# Altium project MB1520.PrjPcb (part 1 of 5)
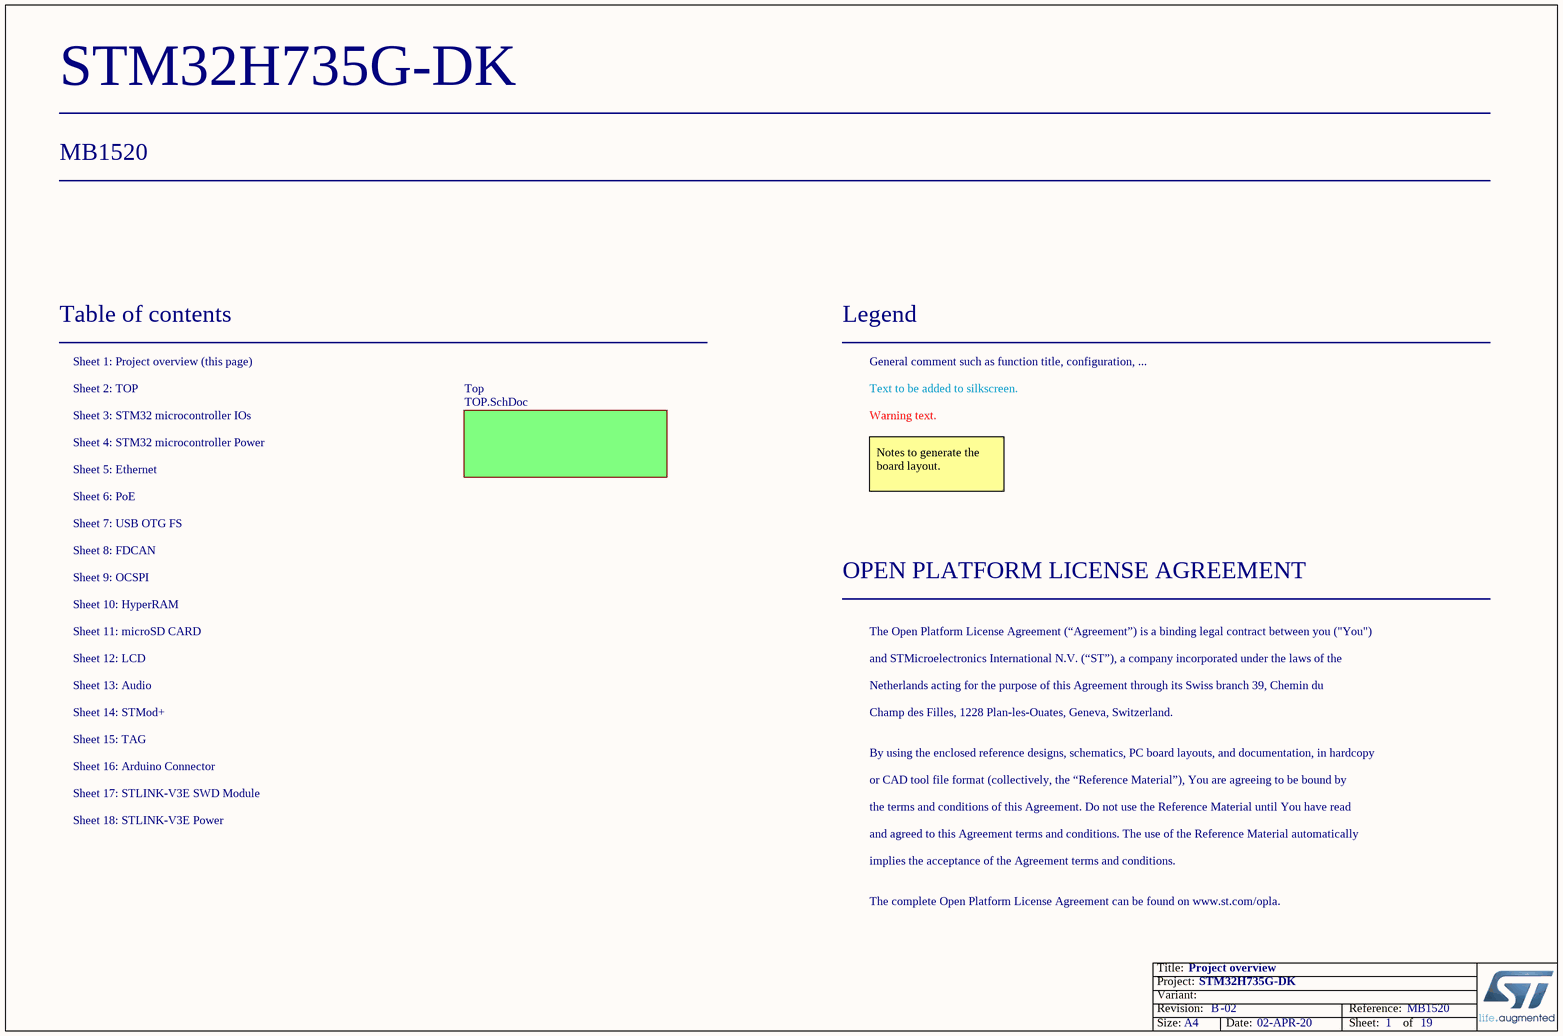
[diagram p0: Project overview.SchDoc]
Board_Assembly_Revision: 02; Board_Document_Date: 02-APR-20; Board_Name: STM32H735G-DK; Board_PCB_Revision: B; Board_Reference: MB1520
18 sheets, 465 parts. Net scope: flat (ports and power ports of the same name join across sheets).
Board file: MB1520.PcbDoc
Sheets:
  Project overview.SchDoc
    Top = TOP.SchDoc
      Power = STM32 microcontroller Power.SchDoc
      TAG = TAG.SchDoc
      Audio = Audio.SchDoc
      USB_OTG_FS = USB OTG FS.SchDoc
      Arduino = Arduino Connector.SchDoc
      STMod+ = STMod+.SchDoc
      U_MCU = STM32 microcontroller IOs.SchDoc
      U_Ethernet = Ethernet.SchDoc
        PoE = PoE.SchDoc
      FDCANs = FDCAN.SchDoc
      STlink_V3E_Module = STlink_V3E_Module.SchDoc
      STlink_V3E_PWR = STlink_V3E_PWR.SchDoc
      U_OCSPI = OCSPI.SchDoc
      U_LCD = LCD.SchDoc
      U_HyperRAM = HyperRAM.SchDoc
      U_SD CARD = SD CARD.SchDoc

## Sheet Project overview.SchDoc: Project overview
size A4; Date: Not used; ApprovedBy: Not used; CheckedBy: Not used; Author: Not used; CompanyName: STMicroelectronics; DrawnBy: Not used; Engineer: Not used; Organization: Not used; Address1: Not used; Address2: Not used; Address3: Not used; Address4: Not used; DocumentNumber: 2; Revision: Not used; SheetNumber: 1; SheetTotal: 19; CurrentTime: Not used; CurrentDate: Not used; Time: Not used; DocumentFullPathAndName: Not used; DocumentName: Not used; ModifiedDate: Not used; ImagePath: Not used; ProjectName: Not used; Application_BuildNumber: Not used

### Sub-sheets
Top = TOP.SchDoc: no entries

### Notes on the sheet
- Table of contents
- Sheet 1: Project overview (this page)
- Legend
- General comment such as function title, configuration, ...
- Sheet 2: TOP
- Sheet 4: STM32 microcontroller Power
- Sheet 3: STM32 microcontroller IOs
- Text to be added to silkscreen.
- Warning text.
- Sheet 6: PoE
- Sheet 5: Ethernet
- Notes to generate the board layout.
- Sheet 8: FDCAN
- Sheet 7: USB OTG FS
- Sheet 9: OCSPI
- OPEN PLATFORM LICENSE AGREEMENT
- Sheet 10: HyperRAM
- Sheet 11: microSD CARD
- The Open Platform License Agreement (“Agreement”) is a binding legal contract between you ("You")
- Sheet 12: LCD
- Sheet 14: STMod+
- Sheet 13: Audio
- and STMicroelectronics International N.V. (“ST”), a company incorporated under the laws of the
- Netherlands acting for the purpose of this Agreement through its Swiss branch 39, Chemin du
- Champ des Filles, 1228 Plan-les-Ouates, Geneva, Switzerland.
- Sheet 16: Arduino Connector
- Sheet 15: TAG
- By using the enclosed reference designs, schematics, PC board layouts, and documentation, in hardcopy
- or CAD tool file format (collectively, the “Reference Material”), You are agreeing to be bound by
- Sheet 18: STLINK-V3E Power
- Sheet 17: STLINK-V3E SWD Module
- the terms and conditions of this Agreement. Do not use the Reference Material until You have read
- and agreed to this Agreement terms and conditions. The use of the Reference Material automatically
- implies the acceptance of the Agreement terms and conditions.
- The complete Open Platform License Agreement can be found on www.st.com/opla.
- Title:
- Project:
- Size:
- Revision:
- Variant:
- A4
- -
- Date:
- Reference:
- Sheet:
- of

## Sheet TOP.SchDoc: TOP
size A3; CompanyName: STMicroelectronics; Organization: Microcontrollers Division; DocumentNumber: 3; SheetNumber: 2; SheetTotal: 19
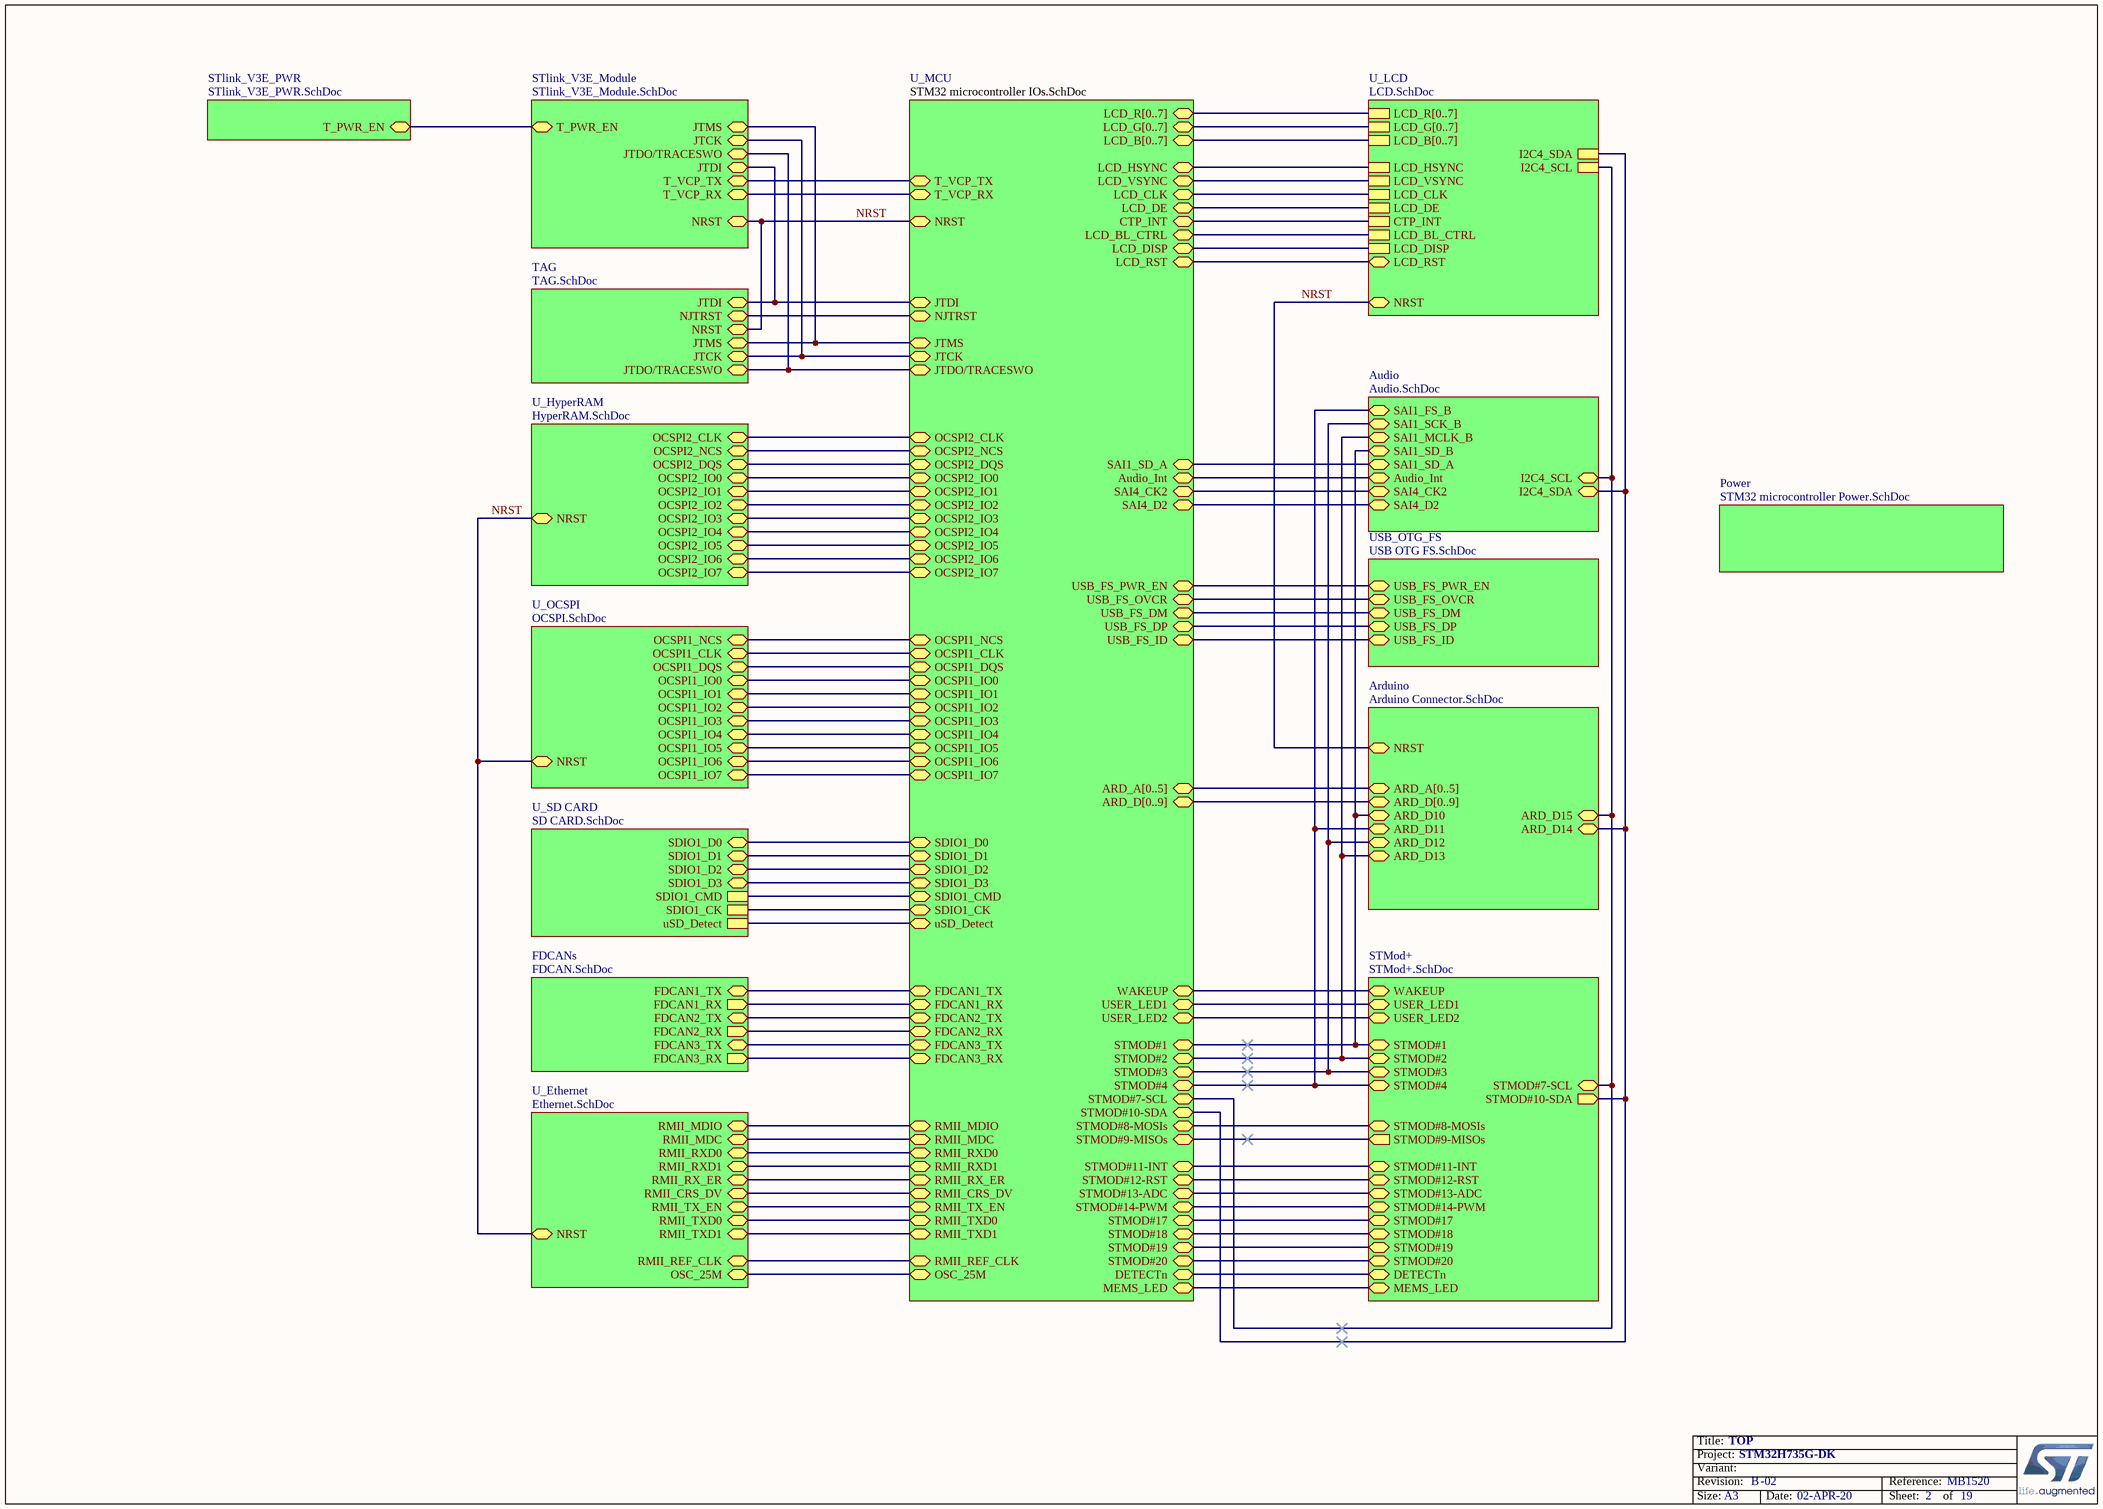
[diagram p1: TOP.SchDoc]

### Sub-sheets
Arduino = Arduino Connector.SchDoc: ARD_D13, ARD_D12, ARD_D11, ARD_D10, ARD_D15, ARD_D14, ARD_A[0..5], ARD_D[0..9], NRST
Audio = Audio.SchDoc: I2C4_SCL, I2C4_SDA, SAI1_SCK_B, SAI1_FS_B, SAI1_SD_B, SAI1_SD_A, Audio_Int, SAI1_MCLK_B, SAI4_D2, SAI4_CK2
FDCANs = FDCAN.SchDoc: FDCAN1_TX, FDCAN2_TX, FDCAN3_TX, FDCAN1_RX (out), FDCAN3_RX (out), FDCAN2_RX (out)
Power = STM32 microcontroller Power.SchDoc: no entries
STlink_V3E_Module = STlink_V3E_Module.SchDoc: T_PWR_EN, T_VCP_TX, T_VCP_RX, JTDO/TRACESWO, JTMS, JTCK, NRST, JTDI
STlink_V3E_PWR = STlink_V3E_PWR.SchDoc: T_PWR_EN
STMod+ = STMod+.SchDoc: STMOD#8-MOSIs, STMOD#14-PWM, STMOD#19, STMOD#20, STMOD#17, STMOD#18, STMOD#1, STMOD#3, STMOD#2, STMOD#4, WAKEUP, USER_LED1, USER_LED2, STMOD#7-SCL, STMOD#10-SDA (out), STMOD#9-MISOs (out), STMOD#12-RST, STMOD#13-ADC, STMOD#11-INT, DETECTn, MEMS_LED
TAG = TAG.SchDoc: JTDO/TRACESWO, JTDI, NJTRST, JTMS, JTCK, NRST
U_Ethernet = Ethernet.SchDoc: OSC_25M, RMII_MDIO, RMII_MDC, RMII_RXD1, RMII_TXD1, RMII_CRS_DV, RMII_RX_ER, RMII_RXD0, RMII_REF_CLK, RMII_TX_EN, RMII_TXD0, NRST
U_HyperRAM = HyperRAM.SchDoc: OCSPI2_NCS (bidir), NRST (bidir), OCSPI2_CLK (bidir), OCSPI2_DQS (bidir), OCSPI2_IO0 (bidir), OCSPI2_IO3 (bidir), OCSPI2_IO1 (bidir), OCSPI2_IO2 (bidir), OCSPI2_IO5 (bidir), OCSPI2_IO4 (bidir), OCSPI2_IO7 (bidir), OCSPI2_IO6 (bidir)
U_LCD = LCD.SchDoc: LCD_R[0..7], I2C4_SDA, I2C4_SCL, LCD_B[0..7], LCD_G[0..7], LCD_HSYNC, LCD_VSYNC, LCD_CLK, LCD_DE, CTP_INT, LCD_BL_CTRL, LCD_DISP, NRST, LCD_RST
U_MCU = STM32 microcontroller IOs.SchDoc: STMOD#14-PWM, STMOD#20, USB_FS_ID, SDIO1_CK, SDIO1_CMD, LCD_DE, LCD_CLK, CTP_INT, USER_LED1, USER_LED2, ARD_A[0..5], ARD_D[0..9], LCD_R[0..7], LCD_G[0..7], LCD_B[0..7], FDCAN3_RX, FDCAN3_TX, T_VCP_TX, T_VCP_RX, FDCAN2_RX, FDCAN2_TX, FDCAN1_TX, FDCAN1_RX, LCD_DISP, LCD_VSYNC, LCD_BL_CTRL, LCD_HSYNC, JTDI, JTDO/TRACESWO, NJTRST, JTCK, JTMS, OCSPI2_NCS, OCSPI1_DQS, OCSPI1_NCS, OCSPI1_CLK, OCSPI2_DQS, OSC_25M, USB_FS_DP, USB_FS_DM, USB_FS_OVCR, USB_FS_PWR_EN, WAKEUP, SAI1_SD_A, SAI4_D2, SAI4_CK2, Audio_Int, STMOD#1, STMOD#2, STMOD#3, STMOD#4, STMOD#19, STMOD#17, STMOD#18, STMOD#10-SDA, STMOD#7-SCL, STMOD#8-MOSIs, STMOD#9-MISOs, STMOD#11-INT, STMOD#13-ADC, STMOD#12-RST, MEMS_LED, DETECTn, uSD_Detect, RMII_RXD1, RMII_RXD0, RMII_CRS_DV, RMII_RX_ER, RMII_TX_EN, RMII_TXD0, RMII_TXD1, RMII_MDIO, RMII_MDC, RMII_REF_CLK, SDIO1_D1, SDIO1_D0, SDIO1_D2, SDIO1_D3, OCSPI2_CLK, NRST, OCSPI1_IO7, OCSPI1_IO4, OCSPI1_IO5, OCSPI1_IO0, OCSPI1_IO1, OCSPI1_IO3, OCSPI1_IO2, OCSPI1_IO6, OCSPI2_IO7, OCSPI2_IO6, OCSPI2_IO5, OCSPI2_IO0, OCSPI2_IO2, OCSPI2_IO1, OCSPI2_IO4, OCSPI2_IO3, LCD_RST
U_OCSPI = OCSPI.SchDoc: OCSPI1_NCS (bidir), OCSPI1_CLK (bidir), NRST, OCSPI1_DQS (bidir), OCSPI1_IO0 (bidir), OCSPI1_IO1 (bidir), OCSPI1_IO2 (bidir), OCSPI1_IO3 (bidir), OCSPI1_IO4 (bidir), OCSPI1_IO5 (bidir), OCSPI1_IO6 (bidir), OCSPI1_IO7 (bidir)
U_SD CARD = SD CARD.SchDoc: SDIO1_CK, SDIO1_CMD, uSD_Detect, SDIO1_D1, SDIO1_D0, SDIO1_D2, SDIO1_D3
USB_OTG_FS = USB OTG FS.SchDoc: USB_FS_ID, USB_FS_PWR_EN, USB_FS_OVCR, USB_FS_DM, USB_FS_DP

### Nets
NRST: sheet TAG/NRST, sheet Arduino/NRST, sheet U_MCU/NRST, sheet U_Ethernet/NRST, sheet STlink_V3E_Module/NRST, sheet U_OCSPI/NRST, sheet U_LCD/NRST, sheet U_HyperRAM/NRST
(unnamed): sheet TAG/JTDO/TRACESWO, sheet U_MCU/JTDO/TRACESWO, sheet STlink_V3E_Module/JTDO/TRACESWO
(unnamed): sheet TAG/JTDI, sheet U_MCU/JTDI, sheet STlink_V3E_Module/JTDI
(unnamed): sheet TAG/NJTRST, sheet U_MCU/NJTRST
(unnamed): sheet TAG/JTMS, sheet U_MCU/JTMS, sheet STlink_V3E_Module/JTMS
(unnamed): sheet TAG/JTCK, sheet U_MCU/JTCK, sheet STlink_V3E_Module/JTCK
(unnamed): sheet Audio/I2C4_SCL, sheet Arduino/ARD_D15, sheet STMod+/STMOD#7-SCL, sheet U_MCU/STMOD#7-SCL, sheet U_LCD/I2C4_SCL
(unnamed): sheet Audio/I2C4_SDA, sheet Arduino/ARD_D14, sheet STMod+/STMOD#10-SDA, sheet U_MCU/STMOD#10-SDA, sheet U_LCD/I2C4_SDA
(unnamed): sheet Audio/SAI1_SCK_B, sheet Arduino/ARD_D12, sheet STMod+/STMOD#3, sheet U_MCU/STMOD#3
(unnamed): sheet Audio/SAI1_FS_B, sheet Arduino/ARD_D11, sheet STMod+/STMOD#4, sheet U_MCU/STMOD#4
(unnamed): sheet Audio/SAI1_SD_B, sheet Arduino/ARD_D10, sheet STMod+/STMOD#1, sheet U_MCU/STMOD#1
(unnamed): sheet Audio/SAI1_SD_A, sheet U_MCU/SAI1_SD_A
(unnamed): sheet Audio/Audio_Int, sheet U_MCU/Audio_Int
(unnamed): sheet Audio/SAI1_MCLK_B, sheet Arduino/ARD_D13, sheet STMod+/STMOD#2, sheet U_MCU/STMOD#2
(unnamed): sheet Audio/SAI4_D2, sheet U_MCU/SAI4_D2
(unnamed): sheet Audio/SAI4_CK2, sheet U_MCU/SAI4_CK2
(unnamed): sheet USB_OTG_FS/USB_FS_ID, sheet U_MCU/USB_FS_ID
(unnamed): sheet USB_OTG_FS/USB_FS_PWR_EN, sheet U_MCU/USB_FS_PWR_EN
(unnamed): sheet USB_OTG_FS/USB_FS_OVCR, sheet U_MCU/USB_FS_OVCR
(unnamed): sheet USB_OTG_FS/USB_FS_DM, sheet U_MCU/USB_FS_DM
(unnamed): sheet USB_OTG_FS/USB_FS_DP, sheet U_MCU/USB_FS_DP
(unnamed): sheet STMod+/STMOD#8-MOSIs, sheet U_MCU/STMOD#8-MOSIs
(unnamed): sheet STMod+/STMOD#14-PWM, sheet U_MCU/STMOD#14-PWM
(unnamed): sheet STMod+/STMOD#19, sheet U_MCU/STMOD#19
(unnamed): sheet STMod+/STMOD#20, sheet U_MCU/STMOD#20
(unnamed): sheet STMod+/STMOD#17, sheet U_MCU/STMOD#17
(unnamed): sheet STMod+/STMOD#18, sheet U_MCU/STMOD#18
(unnamed): sheet STMod+/WAKEUP, sheet U_MCU/WAKEUP
(unnamed): sheet STMod+/USER_LED1, sheet U_MCU/USER_LED1
(unnamed): sheet STMod+/USER_LED2, sheet U_MCU/USER_LED2
(unnamed): sheet STMod+/STMOD#9-MISOs, sheet U_MCU/STMOD#9-MISOs
(unnamed): sheet STMod+/STMOD#12-RST, sheet U_MCU/STMOD#12-RST
(unnamed): sheet STMod+/STMOD#13-ADC, sheet U_MCU/STMOD#13-ADC
(unnamed): sheet STMod+/STMOD#11-INT, sheet U_MCU/STMOD#11-INT
(unnamed): sheet STMod+/DETECTn, sheet U_MCU/DETECTn
(unnamed): sheet STMod+/MEMS_LED, sheet U_MCU/MEMS_LED
(unnamed): sheet U_MCU/SDIO1_CK, sheet U_SD CARD/SDIO1_CK
(unnamed): sheet U_MCU/SDIO1_CMD, sheet U_SD CARD/SDIO1_CMD
(unnamed): sheet U_MCU/LCD_DE, sheet U_LCD/LCD_DE
(unnamed): sheet U_MCU/LCD_CLK, sheet U_LCD/LCD_CLK
(unnamed): sheet U_MCU/CTP_INT, sheet U_LCD/CTP_INT
(unnamed): sheet U_MCU/FDCAN3_RX, sheet FDCANs/FDCAN3_RX
(unnamed): sheet U_MCU/FDCAN3_TX, sheet FDCANs/FDCAN3_TX
(unnamed): sheet U_MCU/T_VCP_TX, sheet STlink_V3E_Module/T_VCP_TX
(unnamed): sheet U_MCU/T_VCP_RX, sheet STlink_V3E_Module/T_VCP_RX
(unnamed): sheet U_MCU/FDCAN2_RX, sheet FDCANs/FDCAN2_RX
(unnamed): sheet U_MCU/FDCAN2_TX, sheet FDCANs/FDCAN2_TX
(unnamed): sheet U_MCU/FDCAN1_TX, sheet FDCANs/FDCAN1_TX
(unnamed): sheet U_MCU/FDCAN1_RX, sheet FDCANs/FDCAN1_RX
(unnamed): sheet U_MCU/LCD_DISP, sheet U_LCD/LCD_DISP
(unnamed): sheet U_MCU/LCD_VSYNC, sheet U_LCD/LCD_VSYNC
(unnamed): sheet U_MCU/LCD_BL_CTRL, sheet U_LCD/LCD_BL_CTRL
(unnamed): sheet U_MCU/LCD_HSYNC, sheet U_LCD/LCD_HSYNC
(unnamed): sheet U_MCU/OCSPI2_NCS, sheet U_HyperRAM/OCSPI2_NCS
(unnamed): sheet U_MCU/OCSPI1_DQS, sheet U_OCSPI/OCSPI1_DQS
(unnamed): sheet U_MCU/OCSPI1_NCS, sheet U_OCSPI/OCSPI1_NCS
(unnamed): sheet U_MCU/OCSPI1_CLK, sheet U_OCSPI/OCSPI1_CLK
(unnamed): sheet U_MCU/OCSPI2_DQS, sheet U_HyperRAM/OCSPI2_DQS
(unnamed): sheet U_MCU/OSC_25M, sheet U_Ethernet/OSC_25M
(unnamed): sheet U_MCU/uSD_Detect, sheet U_SD CARD/uSD_Detect
(unnamed): sheet U_MCU/RMII_RXD1, sheet U_Ethernet/RMII_RXD1
(unnamed): sheet U_MCU/RMII_RXD0, sheet U_Ethernet/RMII_RXD0
(unnamed): sheet U_MCU/RMII_CRS_DV, sheet U_Ethernet/RMII_CRS_DV
(unnamed): sheet U_MCU/RMII_RX_ER, sheet U_Ethernet/RMII_RX_ER
(unnamed): sheet U_MCU/RMII_TX_EN, sheet U_Ethernet/RMII_TX_EN
(unnamed): sheet U_MCU/RMII_TXD0, sheet U_Ethernet/RMII_TXD0
(unnamed): sheet U_MCU/RMII_TXD1, sheet U_Ethernet/RMII_TXD1
(unnamed): sheet U_MCU/RMII_MDIO, sheet U_Ethernet/RMII_MDIO
(unnamed): sheet U_MCU/RMII_MDC, sheet U_Ethernet/RMII_MDC
(unnamed): sheet U_MCU/RMII_REF_CLK, sheet U_Ethernet/RMII_REF_CLK
(unnamed): sheet U_MCU/SDIO1_D1, sheet U_SD CARD/SDIO1_D1
(unnamed): sheet U_MCU/SDIO1_D0, sheet U_SD CARD/SDIO1_D0
(unnamed): sheet U_MCU/SDIO1_D2, sheet U_SD CARD/SDIO1_D2
(unnamed): sheet U_MCU/SDIO1_D3, sheet U_SD CARD/SDIO1_D3
(unnamed): sheet U_MCU/OCSPI2_CLK, sheet U_HyperRAM/OCSPI2_CLK
(unnamed): sheet U_MCU/OCSPI1_IO7, sheet U_OCSPI/OCSPI1_IO7
(unnamed): sheet U_MCU/OCSPI1_IO4, sheet U_OCSPI/OCSPI1_IO4
(unnamed): sheet U_MCU/OCSPI1_IO5, sheet U_OCSPI/OCSPI1_IO5
(unnamed): sheet U_MCU/OCSPI1_IO0, sheet U_OCSPI/OCSPI1_IO0
(unnamed): sheet U_MCU/OCSPI1_IO1, sheet U_OCSPI/OCSPI1_IO1
(unnamed): sheet U_MCU/OCSPI1_IO3, sheet U_OCSPI/OCSPI1_IO3
(unnamed): sheet U_MCU/OCSPI1_IO2, sheet U_OCSPI/OCSPI1_IO2
(unnamed): sheet U_MCU/OCSPI1_IO6, sheet U_OCSPI/OCSPI1_IO6
(unnamed): sheet U_MCU/OCSPI2_IO7, sheet U_HyperRAM/OCSPI2_IO7
(unnamed): sheet U_MCU/OCSPI2_IO6, sheet U_HyperRAM/OCSPI2_IO6
(unnamed): sheet U_MCU/OCSPI2_IO5, sheet U_HyperRAM/OCSPI2_IO5
(unnamed): sheet U_MCU/OCSPI2_IO0, sheet U_HyperRAM/OCSPI2_IO0
(unnamed): sheet U_MCU/OCSPI2_IO2, sheet U_HyperRAM/OCSPI2_IO2
(unnamed): sheet U_MCU/OCSPI2_IO1, sheet U_HyperRAM/OCSPI2_IO1
(unnamed): sheet U_MCU/OCSPI2_IO4, sheet U_HyperRAM/OCSPI2_IO4
(unnamed): sheet U_MCU/OCSPI2_IO3, sheet U_HyperRAM/OCSPI2_IO3
(unnamed): sheet U_MCU/LCD_RST, sheet U_LCD/LCD_RST
(unnamed): sheet STlink_V3E_Module/T_PWR_EN, sheet STlink_V3E_PWR/T_PWR_EN

### Buses and harness runs
bus sheet Arduino/ARD_A[0..5] = sheet U_MCU/ARD_A[0..5]
bus sheet Arduino/ARD_D[0..9] = sheet U_MCU/ARD_D[0..9]
bus sheet U_LCD/LCD_B[0..7] = sheet U_MCU/LCD_B[0..7]
bus sheet U_LCD/LCD_G[0..7] = sheet U_MCU/LCD_G[0..7]
bus sheet U_LCD/LCD_R[0..7] = sheet U_MCU/LCD_R[0..7]

### Notes on the sheet
- Title:
- Project:
- Size:
- Revision:
- Variant:
- A3
- -
- Date:
- Reference:
- Sheet:
- of

## Sheet STM32 microcontroller Power.SchDoc: STM32 microcontroller Power
size A4; CompanyName: STMicroelectronics; Organization: Microcontrollers Division; DocumentNumber: 5; SheetNumber: 4; SheetTotal: 19
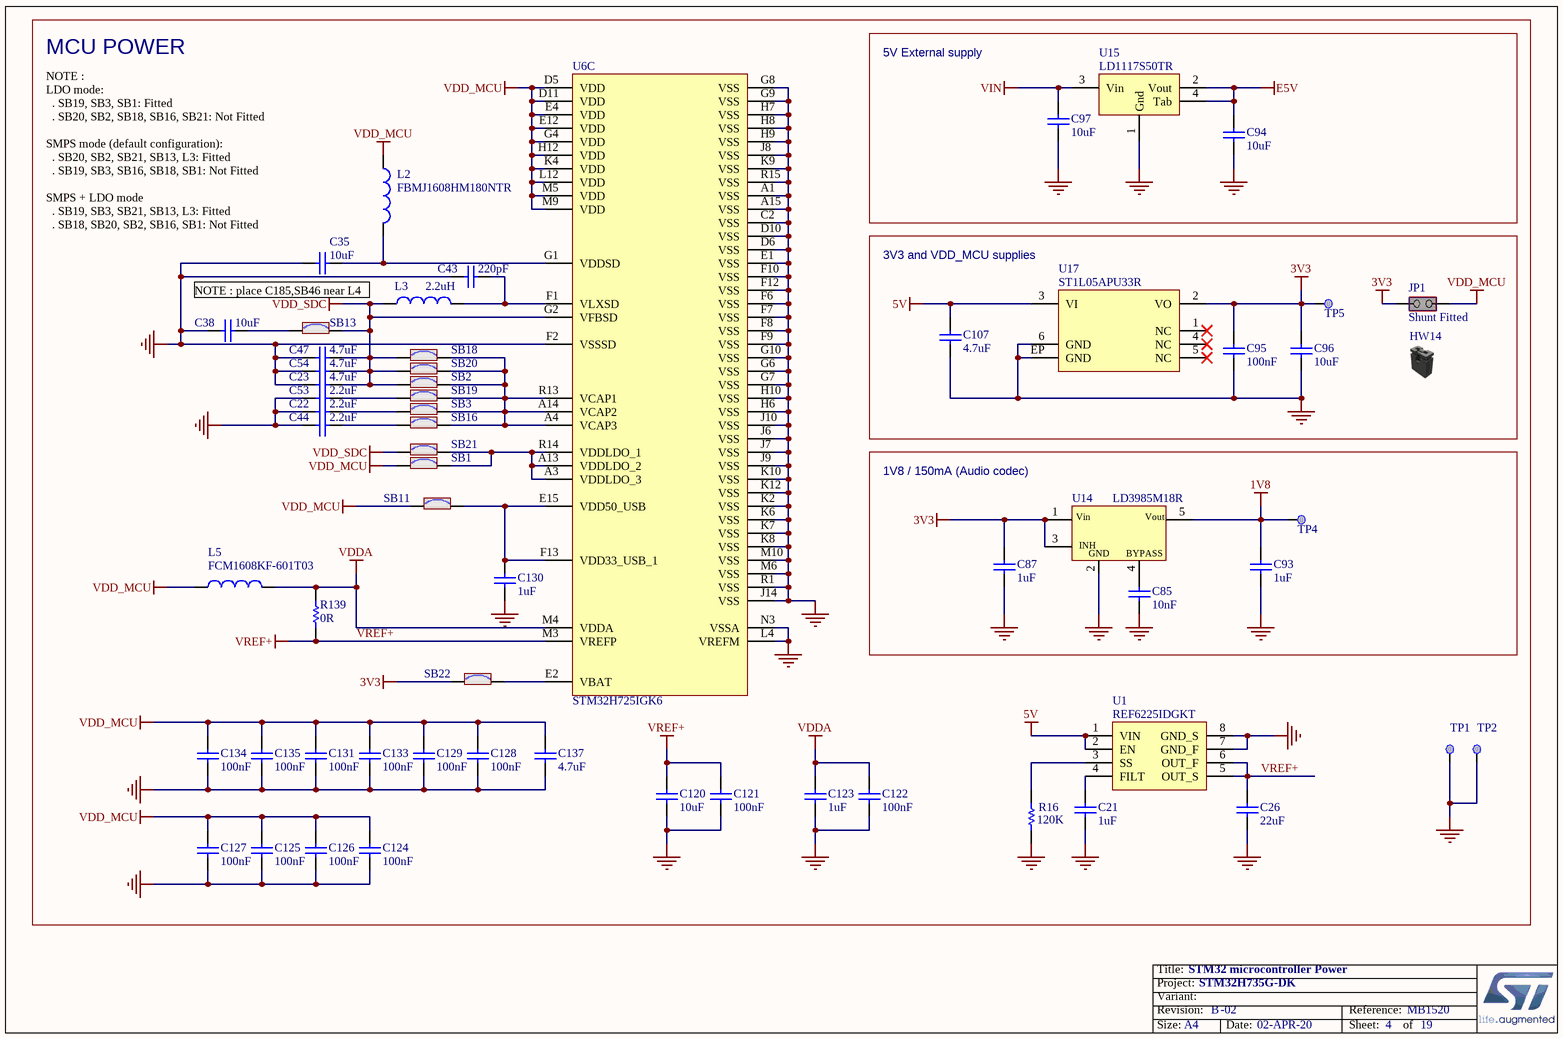
[diagram p2: STM32 microcontroller Power.SchDoc]

### Parts
C21  value 1uF  [C0603]  (hidden comment: Capacitor)
C22  value 2.2uF  [C0603]  (hidden comment: Capacitor)
C23  value 4.7uF  [C0402]  (hidden comment: Capacitor)
C26  value 22uF  [C1210]  (hidden comment: Capacitor)
C35  value 10uF  [C0402]  (hidden comment: Capacitor)
C38  value 10uF  [C0603]  (hidden comment: Capacitor)
C43  value 220pF  [C0402]  (hidden comment: Capacitor)
C44  value 2.2uF  [C0603]  (hidden comment: Capacitor)
C47  value 4.7uF  [C0402]  (hidden comment: Capacitor)
C53  value 2.2uF  [C0603]  (hidden comment: Capacitor)
C54  value 4.7uF  [C0402]  (hidden comment: Capacitor)
C85  value 10nF  [C0402]  (hidden comment: Capacitor)
C87  value 1uF  [C0402]  (hidden comment: Capacitor)
C93  value 1uF  [C0402]  (hidden comment: Capacitor)
C94  value 10uF  [C0805]  (hidden comment: Capacitor)
C95  value 100nF  [C0402]  (hidden comment: Capacitor)
C96  value 10uF  [C0805]  (hidden comment: Capacitor)
C97  value 10uF  [C0805]  (hidden comment: Capacitor)
C107  value 4.7uF  [C0603]  (hidden comment: Capacitor)
C120  value 10uF  [C0805]  (hidden comment: Capacitor)
C121  value 100nF  [C0402]  (hidden comment: Capacitor)
C122  value 100nF  [C0402]  (hidden comment: Capacitor)
C123  value 1uF  [C0402]  (hidden comment: Capacitor)
C124  value 100nF  [C0402]  (hidden comment: Capacitor)
C125  value 100nF  [C0402]  (hidden comment: Capacitor)
C126  value 100nF  [C0402]  (hidden comment: Capacitor)
C127  value 100nF  [C0402]  (hidden comment: Capacitor)
C128  value 100nF  [C0402]  (hidden comment: Capacitor)
C129  value 100nF  [C0402]  (hidden comment: Capacitor)
C130  value 1uF  [C0603]  (hidden comment: Capacitor)
C131  value 100nF  [C0402]  (hidden comment: Capacitor)
C133  value 100nF  [C0402]  (hidden comment: Capacitor)
C134  value 100nF  [C0402]  (hidden comment: Capacitor)
C135  value 100nF  [C0402]  (hidden comment: Capacitor)
C137  value 4.7uF  [C0402]  (hidden comment: Capacitor)
HW14  Shunt Black 2.54mm  (value not drawn)  (mechanical)
JP1  value Shunt Fitted  [CON_SAMTEC_TSW-102-07-G-S]  (hidden comment: Jumper_Header 2x1 Fitted)
L2  value FBMJ1608HM180NTR  [IND_TAIYO-YUDEN_FBMJ1608]  (hidden comment: Inductor)
L3  value 2.2uH  [IND_2016_MURATA_LQM2MPN2R2NG0]  (hidden comment: Inductor)
L5  Manufacturer_Part_Number: FCM1608KF-601T03  [L0603]  (hidden comment: BEAD)
R16  value 120K  [R0402]  (hidden comment: Resistor)
R139  value 0R  [R0603]  (hidden comment: Resistor)
SB1  SB_ON  [SOLDER-BRIDGE_R0603-0R]  (value not drawn)
SB2  SB_ON  [SOLDER-BRIDGE_R0603-0R]  (value not drawn)
SB3  SB_ON  [SOLDER-BRIDGE_R0603-0R]  (value not drawn)
SB11  SB_ON  [SOLDER-BRIDGE_R0603-0R]  (value not drawn)
SB13  SB_ON  [SOLDER-BRIDGE_R0603-0R]  (value not drawn)
SB16  SB_ON  [SOLDER-BRIDGE_R0603-0R]  (value not drawn)
SB18  SB_ON  [SOLDER-BRIDGE_R0603-0R]  (value not drawn)
SB19  SB_ON  [SOLDER-BRIDGE_R0603-0R]  (value not drawn)
SB20  SB_ON  [SOLDER-BRIDGE_R0603-0R]  (value not drawn)
SB21  SB_ON  [SOLDER-BRIDGE_R0603-0R]  (value not drawn)
SB22  SB_ON  [SOLDER-BRIDGE_R0603-0R]  (value not drawn)
TP1  Test Point  [TP_SMD_0-3MM]  (value not drawn)  (no BOM)
TP2  Test Point  [TP_SMD_0-3MM]  (value not drawn)  (no BOM)
TP4  Test Point  [TP_SMD_0-3MM]  (value not drawn)  (no BOM)
TP5  Test Point  [TP_SMD_0-3MM]  (value not drawn)  (no BOM)
U1  REF6225IDGKT  [ICC_VSSOP8_DGK_S-PDSO-G8_3X3_P065]
U6  value STM32H725IGK6  [ICC_UFBGA201_176+25_10X10_P065]  (hidden comment: STM32H725IGK6U)  (part C of 3)
U14  LD3985M18R  [REG_SOT23-5L]
U15  LD1117S50TR  [REG_SOT223-TAB]
U17  ST1L05APU33R  [ICC_DFN6-EPAD_3X3_P095]

### Blocks framed on the sheet
5V External supply: C94 C97 U15
3V3 and VDD_MCU supplies: C95 C96 C107 HW14 JP1 TP5 U17
1V8 / 150mA (Audio codec): C85 C87 C93 TP4 U14

### Nets
1V8: C93.2 TP4.1 U14.5(Vout)
3V3: C87.2 C95.1 C96.2 JP1.2(NO) SB22.1 TP5.1 U14.1(Vin) U14.3(CE) U17.2(VO)
5V: C107.2 U1.1(VIN) U1.2(EN) U17.3(VI)
E5V: C94.2 U15.2(Vout) U15.4(Tab)
GND: C21.1 C22.1 C23.2 C26.1 C35.1 C38.1 C43.1 C44.1 C47.2 C53.1 C54.2 C85.1 C87.1 C93.1 C94.1 C95.2 C96.1 C97.1 C107.1 C120.1 C121.1 C122.1 C123.2 C124.1 C125.1 C126.1 C127.1 C128.1 C129.1 C130.2 C131.1 C133.1 C134.1 C135.1 C137.1 R16.1 TP1.1 TP2.1 U1.7(GND_F) U1.8(GND_S) U6.A1(VSS) U6.A15(VSS) U6.C2(VSS) U6.D6(VSS) U6.D10(VSS) U6.E1(VSS) U6.F2(VSSSD) U6.F6(VSS) U6.F7(VSS) U6.F8(VSS) U6.F9(VSS) U6.F10(VSS) U6.F12(VSS) U6.G6(VSS) U6.G7(VSS) U6.G8(VSS) U6.G9(VSS) U6.G10(VSS) U6.H6(VSS) U6.H7(VSS) U6.H8(VSS) U6.H9(VSS) U6.H10(VSS) U6.J6(VSS) U6.J7(VSS) U6.J8(VSS) U6.J9(VSS) U6.J10(VSS) U6.J14(VSS) U6.K2(VSS) U6.K6(VSS) U6.K7(VSS) U6.K8(VSS) U6.K9(VSS) U6.K10(VSS) U6.K12(VSS) U6.L4(VREFM) U6.M6(VSS) U6.M10(VSS) U6.N3(VSSA) U6.R1(VSS) U6.R15(VSS) U14.2(GND) U15.1(Gnd) U17.6(GND) U17.EP(GND)  [project net POE7]
VDD_MCU: C124.2 C125.2 C126.2 C127.2 C128.2 C129.2 C131.2 C133.2 C134.2 C135.2 C137.2 JP1.1(COMMON) L2.1 L5.1 SB1.1 SB11.1 U6.D5(VDD) U6.D11(VDD) U6.E4(VDD) U6.E12(VDD) U6.G4(VDD) U6.H12(VDD) U6.K4(VDD) U6.L12(VDD) U6.M5(VDD) U6.M9(VDD)
VDD_SDC: C23.1 C47.1 C54.1 L3.1 SB2.1 SB13.2 SB18.1 SB20.1 SB21.1 U6.G2(VFBSD)
VDDA: C122.2 C123.1 L5.2 R139.2 U6.M4(VDDA)
VIN: C97.2 U15.3(Vin)
VREF+: C26.2 C120.2 C121.2 R139.1 U1.5(OUT_S) U1.6(OUT_F) U6.M3(VREFP)
NetC21_2: C21.2 U1.4(FILT)
NetC22_2: C22.2 SB3.1
NetC35_2: C35.2 L2.2 U6.G1(VDDSD)
NetC38_2: C38.2 SB13.1
NetC43_2: C43.2 L3.2 U6.F1(VLXSD)
NetC44_2: C44.2 SB16.1
NetC53_2: C53.2 SB19.1
NetC85_2: C85.2 U14.4(BYPASS)
NetC130_1: C130.1 SB11.2 U6.E15(VDD50_USB) U6.F13(VDD33_USB_1)
NetR16_2: R16.2 U1.3(SS)
NetSB1_2: SB1.2 SB21.2 U6.A3(VDDLDO_3) U6.A13(VDDLDO_2) U6.R14(VDDLDO_1)
NetSB2_2: SB2.2 SB3.2 SB16.2 SB18.2 SB19.2 SB20.2 U6.A4(VCAP3) U6.A14(VCAP2) U6.R13(VCAP1)
NetSB22_2: SB22.2 U6.E2(VBAT)

Not connected (* = marked no-connect by the designer): U17 1(NC)* 4(NC)* 5(NC)*

### Notes on the sheet
- MCU POWER
- (near C35) NOTE :
  LDO mode:
  . SB19, SB3, SB1: Fitted
  . SB20, SB2, SB18, SB16, SB21: Not Fitted
  SMPS mode (default configuration):
  . SB20, SB2, SB21, SB13, L3: Fitted
  . SB19, SB3, SB16, SB18, SB1: Not Fitted
  SMPS + LDO mode
  . SB19, SB3, SB21, SB13, L3: Fitted
  . SB18, SB20, SB2, SB16, SB1: Not Fitted
- NOTE : place C185,SB46 near L4
- Title:
- Project:
- Size:
- Revision:
- Variant:
- A4
- -
- Date:
- Reference:
- Sheet:
- of
- (in symbol MCD-00078) INH

### Library data of the parts
C21 C130 = MCD-00010: Capacitor, MLCC, 1uF, 16V, X5R, 10%, 0603, T=0,8mm; Manufacturer_Part_Number: CC0603KRX5R7BB105; Manufacturer: YAGEO; Provided_By: SUBCO; Internal_Part_Number: MCD-00010; Status: Released; Part_Type: Capacitor; Package: C0603; ComponentLink1Description: Datasheet; ComponentLink1URL: http://tunmcdsvn.tun.st.com/Component_Datasheet_Library/Trunk/Capacitors/Yageo_Multilayer_capacitor_X5R_series_100pF_to_100uF
C22 C44 C53 = MCD-00012: Capacitor, MLCC, 2.2uF, 10V, X5R, 10%, 0603, T=0,8mm; Manufacturer_Part_Number: CC0603KRX5R6BB225; Manufacturer: YAGEO; Alternate_Manufacturer_Part_Number: C0603C225K8PACTU; Alternate_Manufacturer: KEMET; Provided_By: SUBCO; Internal_Part_Number: MCD-00012; Status: Released; Part_Type: Capacitor; Package: C0603; ComponentLink1Description: Datasheet; ComponentLink1URL: http://tunmcdsvn.tun.st.com/Component_Datasheet_Library/Trunk/Capacitors/Yageo_Multilayer_capacitor_X5R_series_100pF_to_100uF
C23 C47 C54 = MCD-01356: Capacitor, MLCC, 4.7uF, 6V3, X5R, 20%, 0402, T=0,5mm; Manufacturer_Part_Number: GRM155R60J475ME47; Manufacturer: MURATA; Provided_By: SUBCO; Internal_Part_Number: MCD-01356; ComponentLink1Description: Datasheet; Status: Released; Part_Type: Capacitor; Package: C0402; ComponentLink1URL: http://tunmcdsvn.tun.st.com/Component_Datasheet_Library/Trunk/Capacitors/Murata_Capacitor_GR_series
C26 = MCD-00614: Capacitor, MLCC, 22uF, 16V, 1210, X7R, 20%, T=2,5mm, ESR 2mohm@410KHz; Manufacturer_Part_Number: GCM32ER71C226ME19; Manufacturer: MURATA; Provided_By: SUBCO; Internal_Part_Number: MCD-00614; Status: Checked; Part_Type: Capacitor; Package: C1210; ComponentLink1Description: Datasheet; ComponentLink1URL: http://tunmcdsvn.tun.st.com/Component_Datasheet_Library/Trunk/Capacitors/Murata_Capacitor_GC_series
C35 = MCD-01355: Capacitor, MLCC, 10uF, 4V, X5R, 20%, 0402, T=0,5mm; Manufacturer_Part_Number: GRM155R60G106ME44; Manufacturer: MURATA; Provided_By: SUBCO; Internal_Part_Number: MCD-01355; ComponentLink1Description: Datasheet; Status: Released; Part_Type: Capacitor; Package: C0402; ComponentLink1URL: http://tunmcdsvn.tun.st.com/Component_Datasheet_Library/Trunk/Capacitors/Murata_Capacitor_GR_series
C38 = MCD-01341: Capacitor, MLCC, 10uF, 6V3, X5R, 20%, 0603, T=0,8mm; Manufacturer_Part_Number: GRM188R60J106ME47D; Manufacturer: MURATA; Provided_By: SUBCO; Internal_Part_Number: MCD-01341; ComponentLink1Description: Datasheet; Status: Released; Part_Type: Capacitor; Package: C0603; ComponentLink1URL: http://tunmcdsvn.tun.st.com/Component_Datasheet_Library/Trunk/Capacitors/Murata_Capacitor_GR_series
C43 = MCD-01225: Capacitor, MLCC, 220pF, 50V, NPO, 5%, 0402, T=0,5mm; Manufacturer_Part_Number: CC0402JRNPO9BN221; Manufacturer: YAGEO; Provided_By: SUBCO; Internal_Part_Number: MCD-01225; Status: Released; Part_Type: Capacitor; Package: C0402; ComponentLink1Description: Datasheet; ComponentLink1URL: http://tunmcdsvn.tun.st.com/Component_Datasheet_Library/Trunk/Capacitors/Yageo_Capacitor_NP0_16V-to-50V
C85 = MCD-00011: Capacitor, MLCC, 10nF, 16V, X7R, 10%, 0402, T=0.5mm; Manufacturer_Part_Number: CC0402KRX7R7BB103; Manufacturer: YAGEO; ECCN_US: EAR99; ECCN_EU: NEC; Provided_By: SUBCO; Internal_Part_Number: MCD-00011; Status: Released; Part_Type: Capacitor; Package: C0402; ComponentLink1Description: Datasheet; ComponentLink1URL: http://tunmcdsvn.tun.st.com/Component_Datasheet_Library/Trunk/Capacitors/Yageo_Multilayer_Capacitor_X7R_series_100pF_to_22uF
C87 C93 = MCD-00095: Capacitor, MLCC, 1uF, 6V3, X5R, 10%, 0402, T=0,5mm; Manufacturer_Part_Number: GRM155R61E105KA12; Manufacturer: MURATA; Alternate_Manufacturer_Part_Number: GRM155R60J105KE19; ECCN_US: EAR99; ECCN_EU: NEC; Provided_By: SUBCO; Internal_Part_Number: MCD-00095; Status: Released; Part_Type: Capacitor; Alternate_Manufacturer: MURATA; Package: C0402; ComponentLink1Description: Datasheet; ComponentLink1URL: http://tunmcdsvn.tun.st.com/Component_Datasheet_Library/Trunk/Capacitors/Murata_Capacitor_GR_series
C94 C96 C97 C120 = MCD-00014: Capacitor, MLCC, 10uF, 25V, X5R, 10%, 0805, T=0,85mm; Manufacturer_Part_Number: CC0805KRX5R8BB106; Manufacturer: YAGEO; Provided_By: SUBCO; Internal_Part_Number: MCD-00014; ComponentLink1Description: Datasheet; Status: Released; Part_Type: Capacitor; Package: C0805; ComponentLink1URL: http://tunmcdsvn.tun.st.com/Component_Datasheet_Library/Trunk/Capacitors/Yageo_Multilayer_capacitor_X5R_series_100pF_to_100uF
C95 C121 C122 C124-C129 C131 C133-C135 = MCD-00102: Capacitor, MLCC, 100nF, 16V, X7R, 10%, 0402, T=0,5mm; Manufacturer_Part_Number: CC0402KRX7R7BB104; Manufacturer: YAGEO; Alternate_Manufacturer_Part_Number: GCM155R71C104KA55D; Alternate_Manufacturer: MURATA; Provided_By: SUBCO; Internal_Part_Number: MCD-00102; Status: Released; Part_Type: Capacitor; Package: C0402; ComponentLink1Description: Datasheet; ComponentLink1URL: http://tunmcdsvn.tun.st.com/Component_Datasheet_Library/Trunk/Capacitors/Yageo_Multilayer_Capacitor_X7R_series_100pF_to_22uF
C107 = MCD-00097: Capacitor, MLCC, 4.7uF, 16V, X5R, 20%, 0603, T=0,8mm; Manufacturer_Part_Number: GRM188R61C475KE11; Manufacturer: MURATA; Alternate_Manufacturer_Part_Number: GRM188R61C475MAAJ; ECCN_US: EAR99; ECCN_EU: NEC; Provided_By: SUBCO; Internal_Part_Number: MCD-00097; Status: Released; Part_Type: Capacitor; Alternate_Manufacturer: Murata; Package: C0603; ComponentLink1Description: Datasheet; ComponentLink1URL: http://tunmcdsvn.tun.st.com/Component_Datasheet_Library/Trunk/Capacitors/Murata_Capacitor_GR_series
C123 = MCD-01722: Capacitor, 1uF, 10V, X5R, 10%, 0402, T=0.5mm; Manufacturer_Part_Number: CC0402KRX5R6BB105; Manufacturer: YAGEO; Provided_By: SUBCO; Internal_Part_Number: MCD-01722; Status: Released; Part_Type: Capacitor; Package: C0402; ComponentLink1Description: Datasheet; ComponentLink1URL: http://tunmcdsvn.tun.st.com/Component_Datasheet_Library/Trunk/Capacitors/Yageo_Multilayer_capacitor_X5R_series_100pF_to_100uF/Yageo_Multilayer_capacitor_X5R_100pF_to_100uF.pdf; ECCN_US: N/A; ECCN_EU: N/A
C137 = MCD-01356: Capacitor, MLCC, 4.7uF, 6V3, X5R, 20%, 0402, T=0,5mm; Manufacturer_Part_Number: GRM155R60J475ME47; Manufacturer: MURATA; ECCN_US: EAR99; ECCN_EU: NEC; Provided_By: SUBCO; Internal_Part_Number: MCD-01356; Status: Released; Part_Type: Capacitor; Package: C0402; ComponentLink1Description: Datasheet; ComponentLink1URL: http://tunmcdsvn.tun.st.com/Component_Datasheet_Library/Trunk/Capacitors/Murata_Capacitor_GR_series
HW14 = MCD-00043: SHUNT 2.54mm BLACK; Manufacturer_Part_Number: SNT-100-BK-G; Manufacturer: SAMTEC; Part_Type: Mechanical; Alternate_Manufacturer_Part_Number: 316102S111A; Alternate_Manufacturer: JIUBABA; Provided_By: SUBCO; Value: SNT-100-BK-G; Internal_Part_Number: MCD-00043; ComponentLink1Description: Datasheet; Status: Released; ComponentLink1URL: http://tunmcdsvn.tun.st.com/Component_Datasheet_Library/Trunk/Connectors/Samtec_Shunt_Jumper_SNT100
JP1 = MCD-00683: Header, 2x1, 2,54mm, VR, TH, Height 5.84mm/2.54mm - Shunt Fitted by default; Part_Type: Connector; Manufacturer_Part_Number: TSW-102-07-x-S; Manufacturer: SAMTEC; Provided_By: SUBCO; Internal_Part_Number: MCD-00683; Status: Released; ComponentLink1Description: Datasheet; ComponentLink1URL: http://tunmcdsvn.tun.st.com/Component_Datasheet_Library/Trunk/Connectors/Samtec_TSW-HTSW-series
L2 = MCD-01431: Ferrite Bead 18 ohm@100MHz 0603; Manufacturer: TAIYO YUDEN; Provided_By: SUBCO; Internal_Part_Number: MCD-01431; Status: Checked; Part_Type: Inductor; Manufacturer_Part_Number: FBMJ1608HM180NTR; Package: L0603; ComponentLink1Description: Datasheet; ComponentLink1URL: http://tunmcdsvn.tun.st.com/Component_Datasheet_Library/Trunk/Inductors/TaiyoYuden_Bead_FBA,%20FBR%20Series/TaiyoYuden_Bead_FBA,%20FBR%20Series.pdf
L3 = MCD-01110: Inductor 2.2uH, 2x1.6x0.9mm; Manufacturer_Part_Number: LQM2MPN2R2NG0; Manufacturer: MURATA; Provided_By: SUBCO; Internal_Part_Number: MCD-01110; Status: Footprint available; Part_Type: Inductor; ComponentLink1Description: Datasheet; ComponentLink1URL: http://tunmcdsvn.tun.st.com/Component_Datasheet_Library/Trunk/Inductors/Murata_inductor_LQM2MPN/Murata_inductor_LQM2MPN.pdf; ECCN_US: n/a; ECCN_EU: n/a
L5 = MCD-00047: SMD Chip ferrite bead, 600R@100MHz +/-25%, 350mA, 500mohm DC, 0603, T=0.8mm; Part_Type: Inductor; Manufacturer: TAI-TECH; Provided_By: SUBCO; Internal_Part_Number: MCD-00047; Value: 600R@100MHz; Status: Released; ComponentLink1Description: Datasheet; ComponentLink1URL: http://tunmcdsvn.tun.st.com/Component_Datasheet_Library/Trunk/Inductors/TaiTech_Bead_FCM1608_series
R16 = MCD-00166: Resistor,120K,0402,1%,1/16W; Manufacturer_Part_Number: RC0402FR-07120KL; Manufacturer: YAGEO; Provided_By: SUBCO; Internal_Part_Number: MCD-00166; Status: Footprint available; Part_Type: Resistor; Package: R0402; ComponentLink1Description: Datasheet; ComponentLink1URL: http://tunmcdsvn.tun.st.com/Component_Datasheet_Library/Trunk/Resistors/Yageo_Resistor_RC0402-series
R139 = MCD-00056: Resistor,0R,0603,5%,1/10W; Manufacturer_Part_Number: RC0603JR-070RL; Manufacturer: YAGEO; ECCN_US: EAR99; ECCN_EU: NEC; Provided_By: SUBCO; Internal_Part_Number: MCD-00056; Status: Released; Part_Type: Resistor; Package: R0603; ComponentLink1Description: Datasheet; ComponentLink1URL: http://tunmcdsvn.tun.st.com/Component_Datasheet_Library/Trunk/Resistors/Yageo_Resistor_RC0603-series
SB1-SB3 SB11 SB13 SB16 SB18-SB22 = MCD-00071: Solder Bridge ON; Part_Type: Mechanical; Manufacturer_Part_Number: RC0603JR-070RL; Manufacturer: YAGEO; Provided_By: SUBCO; Internal_Part_Number: MCD-00071; Status: Released; Package: SB0603; ComponentLink1Description: Datasheet; ComponentLink1URL: http://tunmcdsvn.tun.st.com/Component_Datasheet_Library/Trunk/Resistors/Yageo_Resistor_RC0603-series
TP1 TP2 TP4 TP5 = MCD-00630: Test Point 0.3mm; Part_Type: Mechanical; Internal_Part_Number: MCD-00630; Status: Released; Provided_By: n/a; ComponentLink1Description: Datasheet
U1 = MCD-01138: IC VREF SERIES 2.5V 8VSSOP; Manufacturer: TI; Provided_By: SUBCO; Internal_Part_Number: MCD-01138; Value: REF6225IDGKT; Status: Footprint available; Part_Type: IC; Manufacturer_Part_Number: REF6225IDGKT; Package: VSSOP8; ComponentLink1Description: Datasheet; ComponentLink1URL: http://tunmcdsvn.tun.st.com/Component_Datasheet_Library/Trunk/IC/TI_REF_REF6225IDGKT/TI_REF_REF6225IDGKT.pdf
U6 = MCD-01673: STM32H725IGK6 MCU, Cut1.0, 10x10x0.6mm, Pitch0.65mm, Int SMPS; Part_Type: IC; Manufacturer: STMICROELECTRONICS; ECCN_US: 3A991A2; ECCN_EU: NEC; Provided_By: SUBCO with ST control; Internal_Part_Number: MCD-01673; Status: Checked; Manufacturer_Part_Number: STM32H725IGK6; Package: UFBGA176+25; ComponentLink1Description: Datasheet; ComponentLink1URL: http://tunmcdsvn.tun.st.com/Component_Datasheet_Library/Trunk/IC/STM_MCU_STM32H725IGK6U_UFBGA176
U14 = MCD-00078: Ultra low drop-low noise BiCMOS voltage, regulators low ESR capacitors compatible; Part_Type: IC; Manufacturer: STMICROELECTRONICS; BMS_Part_Number: 9176159; ECCN_US: EAR99; ECCN_EU: NEC; Provided_By: SUBCO with ST control; Internal_Part_Number: MCD-00078; Value: LD3985M18R; Status: Released; Manufacturer_Part_Number: LD3985M18R; ComponentLink1Description: Datasheet; ComponentLink1URL: http://tunmcdsvn.tun.st.com/Component_Datasheet_Library/Trunk/IC/STM_LDO_LD3985
U15 = MCD-00088: IC REG LDO 5V 0.8A SOT223; Manufacturer: STMICROELECTRONICS; BMS_Part_Number: 9176133; Provided_By: SUBCO with ST control; Internal_Part_Number: MCD-00088; Value: LD1117S50TR; Status: Released; Part_Type: IC; Manufacturer_Part_Number: LD1117S50TR; ComponentLink1Description: Datasheet; ComponentLink1URL: http://tunmcdsvn.tun.st.com/Component_Datasheet_Library/Trunk/IC/STM_LDO_LD1117; Package: SOT-223
U17 = MCD-01127: IC REG LDO 3.3V 1.3A 6DFN; Manufacturer: STMICROELECTRONICS; BMS_Part_Number: 9176247; Provided_By: SUBCO with ST control; Internal_Part_Number: MCD-01127; Value: ST1L05APU33R; Status: Footprint available; Part_Type: IC; Manufacturer_Part_Number: ST1L05APU33R; Package: DFN6; ComponentLink1Description: Datasheet; ComponentLink1URL: http://tunmcdsvn.tun.st.com/Component_Datasheet_Library/Trunk/IC/STM_LDO_ST1L05CPU33R/STM_LDO_ST1L05CPU33R.pdf

## Sheet TAG.SchDoc: TAG
size A4; CompanyName: STMicroelectronics; Organization: Microcontrollers Division; DocumentNumber: 9; SheetNumber: 15; SheetTotal: 19
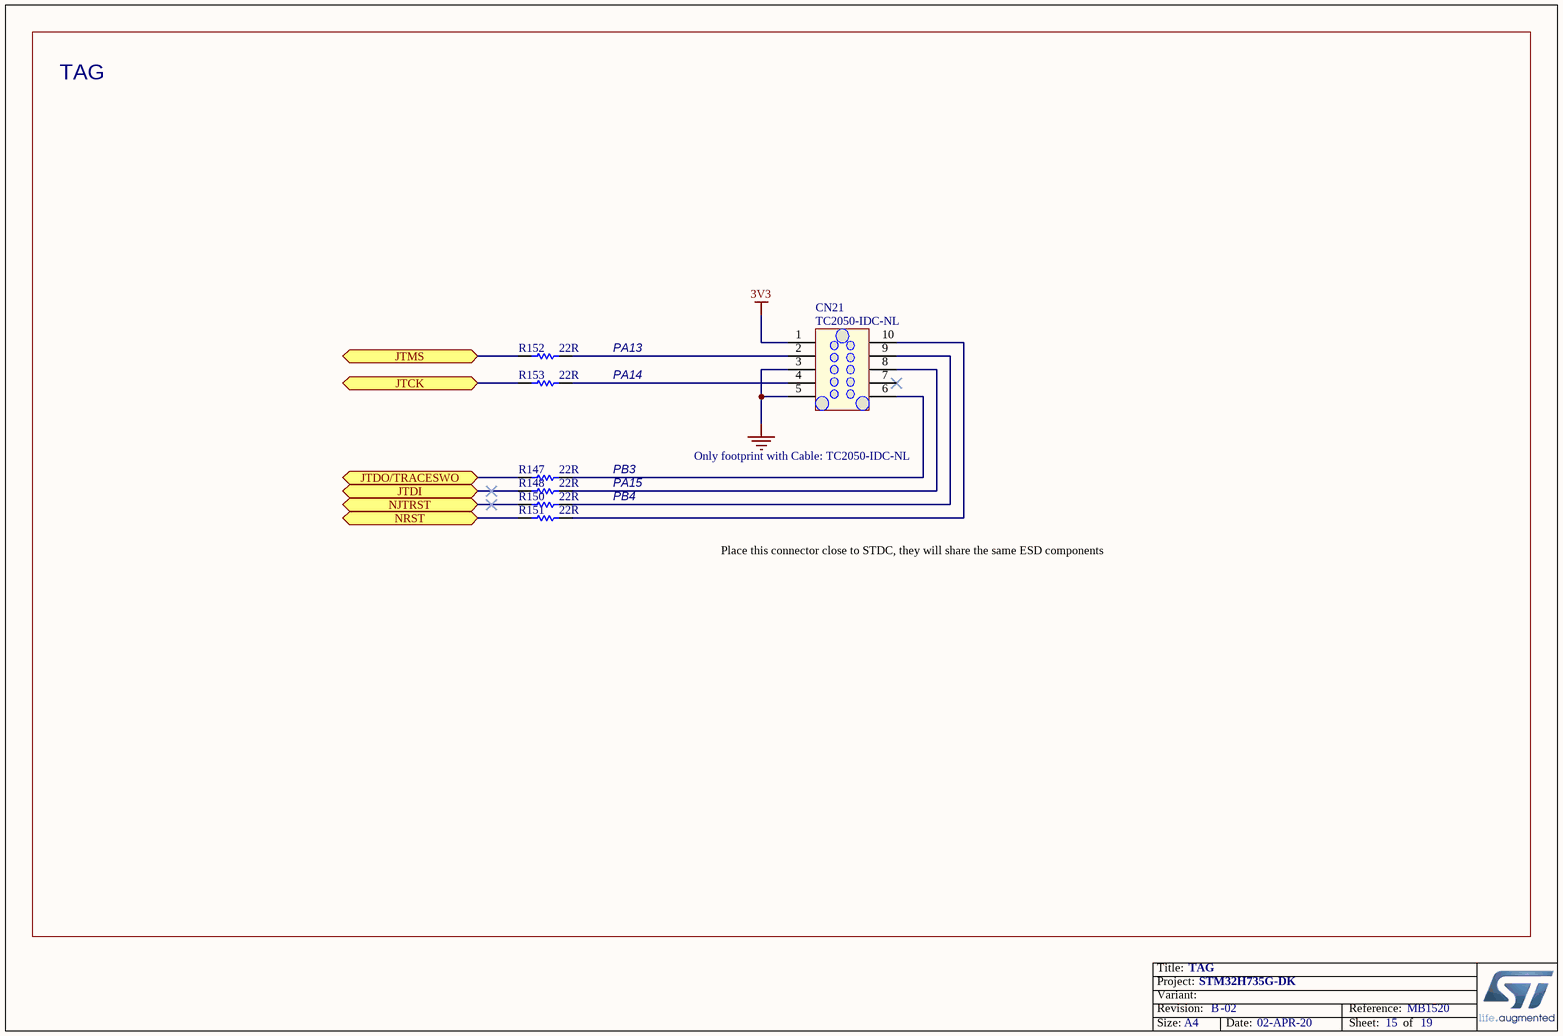
[diagram p3: TAG.SchDoc]

### Parts
CN21  value TC2050-IDC-NL  [CON_TAG-C_TC2050-IDC-NL]  (hidden comment: Tag-10-C)
R147  value 22R  [R0402]  (hidden comment: Resistor)
R148  value 22R  [R0402]  (hidden comment: Resistor)
R150  value 22R  [R0402]  (hidden comment: Resistor)
R151  value 22R  [R0402]  (hidden comment: Resistor)
R152  value 22R  [R0402]  (hidden comment: Resistor)
R153  value 22R  [R0402]  (hidden comment: Resistor)

### Ports
JTCK, JTDI, JTDO/TRACESWO, JTMS, NJTRST, NRST

### Nets
3V3: CN21.1
GND: CN21.3 CN21.5  [project net POE7]
NJTRST: R150.1 ; port NJTRST
RESET: R151.1 ; port NRST
T_JTDI: R148.1 ; port JTDI
T_SWCLK: R153.1 ; port JTCK
T_SWDIO: R152.1 ; port JTMS
T_SWO: R147.1 ; port JTDO/TRACESWO
NetCN21_2: CN21.2 R152.2
NetCN21_4: CN21.4 R153.2
NetCN21_6: CN21.6 R147.2
NetCN21_8: CN21.8 R148.2
NetCN21_9: CN21.9 R150.2
NetCN21_10: CN21.10 R151.2

Not connected (* = marked no-connect by the designer): CN21 7*

### Notes on the sheet
- TAG
- PA13
- PA14
- PB3
- PA15
- PB4
- Only footprint with Cable: TC2050-IDC-NL
- Place this connector close to STDC, they will share the same ESD components
- Title:
- Project:
- Size:
- Revision:
- Variant:
- A4
- -
- Date:
- Reference:
- Sheet:
- of

### Library data of the parts
CN21 = MCD-00031: Tag_Connector Header, 10x2, No legs; Manufacturer_Part_Number: TC2050-IDC-NL-FP; Manufacturer: TAG-CONNECT LLC; Provided_By: SUBCO; Internal_Part_Number: MCD-00031; Status: Released; Part_Type: Connector; ComponentLink1Description: Datasheet; ComponentLink1URL: http://tunmcdsvn.tun.st.com/Component_Datasheet_Library/Trunk/Connectors/TAG_Connector_TC2050-IDC-NLFP
R147 R148 R150-R153 = MCD-00189: Resistor,22R,0402,1%,1/16W; Manufacturer_Part_Number: RC0402FR-0722RL; Manufacturer: YAGEO; Provided_By: SUBCO; Internal_Part_Number: MCD-00189; Status: Released; Part_Type: Resistor; Package: R0402; ComponentLink1Description: Datasheet; ComponentLink1URL: http://tunmcdsvn.tun.st.com/Component_Datasheet_Library/Trunk/Resistors/Yageo_Resistor_RC0402-series

## Sheet Audio.SchDoc: Audio
size A4; CompanyName: STMicroelectronics; Organization: Microcontrollers Division; DocumentNumber: 6; SheetNumber: 13; SheetTotal: 19
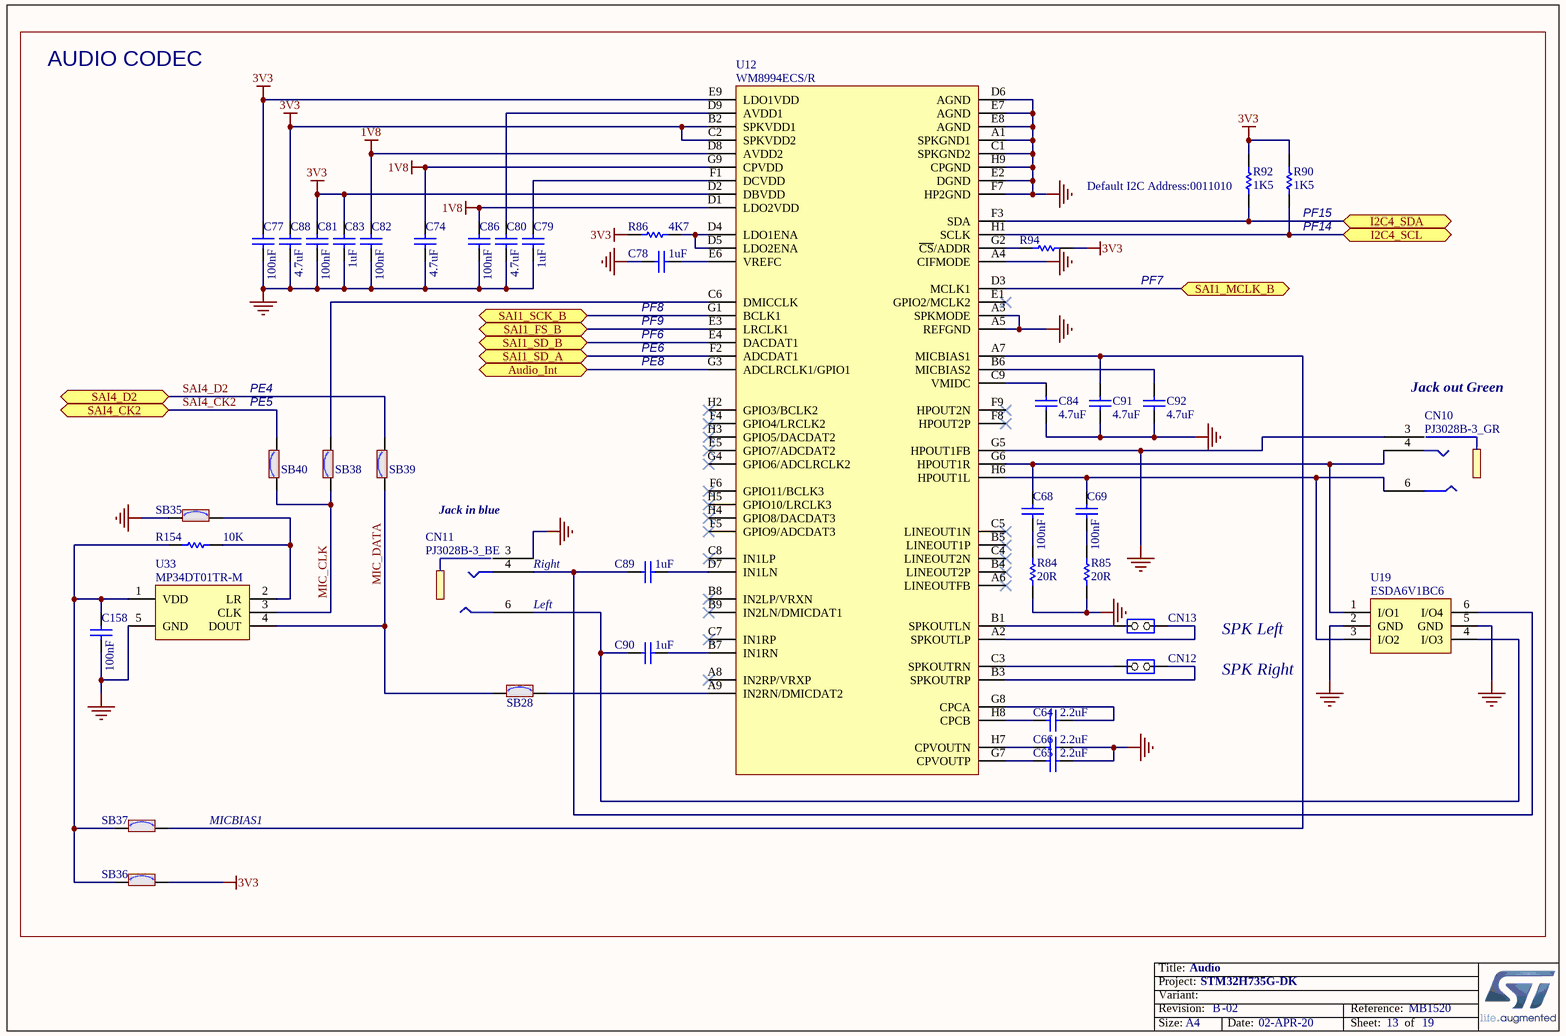
[diagram p4: Audio.SchDoc]

### Parts
C64  value 2.2uF  [C0603]  (hidden comment: Capacitor)
C65  value 2.2uF  [C0603]  (hidden comment: Capacitor)
C66  value 2.2uF  [C0603]  (hidden comment: Capacitor)
C68  value 100nF  [C0402]  (hidden comment: Capacitor)
C69  value 100nF  [C0402]  (hidden comment: Capacitor)
C74  value 4.7uF  [C0603]  (hidden comment: Capacitor)
C77  value 100nF  [C0402]  (hidden comment: Capacitor)
C78  value 1uF  [C0603]  (hidden comment: Capacitor)
C79  value 1uF  [C0603]  (hidden comment: Capacitor)
C80  value 4.7uF  [C0603]  (hidden comment: Capacitor)
C81  value 100nF  [C0402]  (hidden comment: Capacitor)
C82  value 100nF  [C0402]  (hidden comment: Capacitor)
C83  value 1uF  [C0603]  (hidden comment: Capacitor)
C84  value 4.7uF  [C0603]  (hidden comment: Capacitor)
C86  value 100nF  [C0402]  (hidden comment: Capacitor)
C88  value 4.7uF  [C0603]  (hidden comment: Capacitor)
C89  value 1uF  [C0603]  (hidden comment: Capacitor)
C90  value 1uF  [C0603]  (hidden comment: Capacitor)
C91  value 4.7uF  [C0603]  (hidden comment: Capacitor)
C92  value 4.7uF  [C0603]  (hidden comment: Capacitor)
C158  value 100nF  [C0402]  (hidden comment: Capacitor)
CN10  value PJ3028B-3_GR  [CON_PHONE-JACK-3P5_HY_PJ3028B]  (hidden comment: Jack_PJ3028B-3_3P)
CN11  value PJ3028B-3_BE  [CON_PHONE-JACK-3P5_HY_PJ3028B]  (hidden comment: Jack_PJ3028B-3_3P)
CN12  Jumper_Header 2x1  [CON_SAMTEC_TSW-102-07-G-S]  (value not drawn)
CN13  Jumper_Header 2x1  [CON_SAMTEC_TSW-102-07-G-S]  (value not drawn)
R84  value 20R  [R0603]  (hidden comment: Resistor)
R85  value 20R  [R0603]  (hidden comment: Resistor)
R86  value 4K7  [R0603]  (hidden comment: Resistor)
R90  value 1K5  [R0402]  (hidden comment: Resistor)
R92  value 1K5  [R0402]  (hidden comment: Resistor)
R94  Resistor  [R0402]  (value not drawn)
R154  value 10K  [R0402]  (hidden comment: Resistor)
SB28  SB_ON  [SOLDER-BRIDGE_R0603-0R]  (value not drawn)
SB35  SB_ON  [SOLDER-BRIDGE_R0603-0R]  (value not drawn)
SB36  SB_ON  [SOLDER-BRIDGE_R0603-0R]  (value not drawn)
SB37  SB_ON  [SOLDER-BRIDGE_R0603-0R]  (value not drawn)
SB38  SB_ON  [SOLDER-BRIDGE_R0603-0R]  (value not drawn)
SB39  SB_ON  [SOLDER-BRIDGE_R0603-0R]  (value not drawn)
SB40  SB_ON  [SOLDER-BRIDGE_R0603-0R]  (value not drawn)
U12  WM8994ECS/R  [ICC_W-CSP-BGA72_4P511X4P023_P050]
U19  ESDA6V1BC6  [ESD_SOT23-6L]
U33  MP34DT01TR-M  [MIC_HCLGA_3X4X1_4LD]

### Ports
Audio_Int, I2C4_SCL, I2C4_SDA, SAI1_FS_B, SAI1_MCLK_B, SAI1_SCK_B, SAI1_SD_A, SAI1_SD_B, SAI4_CK2, SAI4_D2

### Nets
1V8: C74.2 C82.1 C86.1 U12.D1(LDO2VDD) U12.D8(AVDD2) U12.G9(CPVDD)
3V3: C77.1 C81.1 C83.2 C88.2 R86.1 R90.2 R92.2 R94.1 SB36.2 U12.B2(SPKVDD1) U12.C2(SPKVDD2) U12.D2(DBVDD) U12.E9(LDO1VDD)
GND: C65.1 C66.1 C74.1 C77.2 C78.2 C79.1 C80.1 C81.2 C82.2 C83.1 C84.1 C86.2 C88.1 C91.1 C92.1 C158.2 CN10.3 CN11.3 R84.1 R85.1 SB35.1 U12.A1(SPKGND1) U12.A3(SPKMODE) U12.A4(CIFMODE) U12.A5(REFGND) U12.C1(SPKGND2) U12.D6(AGND) U12.E2(DGND) U12.E7(AGND) U12.E8(AGND) U12.F7(HP2GND) U12.G5(HPOUT1FB) U12.H9(CPGND) U19.2(GND) U19.5(GND) U33.5(GND)  [project net POE7]
Audio_Int: U12.G3(ADCLRCLK1/GPIO1) ; port Audio_Int
I2C4_SCL: R90.1 U12.H1(SCLK) ; port I2C4_SCL
I2C4_SDA: R92.1 U12.F3(SDA) ; port I2C4_SDA
MIC_CLK: SB38.1 SB40.1 U33.3(CLK)
MIC_DATA: SB28.1 SB39.1 U33.4(DOUT)
SAI1_FS_B: U12.E3(LRCLK1) ; port SAI1_FS_B
SAI1_MCLK_B: U12.D3(MCLK1) ; port SAI1_MCLK_B
SAI1_SCK_B: U12.G1(BCLK1) ; port SAI1_SCK_B
SAI1_SD_A: U12.F2(ADCDAT1) ; port SAI1_SD_A
SAI1_SD_B: U12.E4(DACDAT1) ; port SAI1_SD_B
SAI4_CK2: SB40.2 ; port SAI4_CK2
SAI4_D2: SB39.2 ; port SAI4_D2
NetC64_1: C64.1 U12.G8(CPCA)
NetC64_2: C64.2 U12.H8(CPCB)
NetC65_2: C65.2 U12.G7(CPVOUTP)
NetC66_2: C66.2 U12.H7(CPVOUTN)
NetC68_1: C68.1 CN10.4 U12.G6(HPOUT1R) U19.1(I/O1)
NetC68_2: C68.2 R84.2
NetC69_1: C69.1 CN10.6 U12.H6(HPOUT1L) U19.3(I/O2)
NetC69_2: C69.2 R85.2
NetC78_1: C78.1 U12.E6(VREFC)
NetC79_2: C79.2 U12.F1(DCVDD)
NetC80_2: C80.2 U12.D9(AVDD1)
NetC84_2: C84.2 U12.C9(VMIDC)
NetC89_1: C89.1 U12.D7(IN1LN)
NetC89_2: C89.2 CN11.4 U19.6(I/O4)
NetC90_1: C90.1 U12.B7(IN1RN)
NetC90_2: C90.2 CN11.6 U19.4(I/O3)
NetC91_2: C91.2 SB37.2 U12.A7(MICBIAS1)
NetC92_2: C92.2 U12.B6(MICBIAS2)
NetC158_1: C158.1 R154.2 SB36.1 SB37.1 U33.1(VDD)
NetCN12_1: CN12.1(COMMON) U12.B3(SPKOUTRP)
NetCN12_2: CN12.2(NO) U12.C3(SPKOUTRN)
NetCN13_1: CN13.1(COMMON) U12.A2(SPKOUTLP)
NetCN13_2: CN13.2(NO) U12.B1(SPKOUTLN)
NetR86_2: R86.2 U12.D4(LDO1ENA) U12.D5(LDO2ENA)
NetR94_2: R94.2 U12.G2(~{CS}/ADDR)
NetR154_1: R154.1 SB35.2 U33.2(LR)
NetSB28_2: SB28.2 U12.A9(IN2RN/DMICDAT2)
NetSB38_2: SB38.2 U12.C6(DMICCLK)

Not connected (* = marked no-connect by the designer): U12 A6(LINEOUTFB)* A8(IN2RP/VRXP)* B4(LINEOUT2P)* B5(LINEOUT1P)* B8(IN2LP/VRXN)* B9(IN2LN/DMICDAT1)* C4(LINEOUT2N)* C5(LINEOUT1N)* C7(IN1RP)* C8(IN1LP)* E1(GPIO2/MCLK2)* E5(GPIO7/ADCDAT2)* F4(GPIO4/LRCLK2)* F5(GPIO9/ADCDAT3)* F6(GPIO11/BCLK3)* F8(HPOUT2P)* F9(HPOUT2N)* G4(GPIO6/ADCLRCLK2)* H2(GPIO3/BCLK2)* H3(GPIO5/DACDAT2)* H4(GPIO8/DACDAT3)* H5(GPIO10/LRCLK3)*

### Notes on the sheet
- AUDIO CODEC
- (near R92) Default I2C Address:0011010
- (near R90) PF15
- (near R90) PF14
- (near C78) PF8
- PF7
- PF6
- PF9
- PE8
- PE6
- PE4
- (near SB40) PE5
- (near CN10) Jack out Green
- Jack in blue
- (near CN11) Right
- (near CN11) Left
- SPK Left
- SPK Right
- MICBIAS1
- Title:
- Project:
- Size:
- Revision:
- Variant:
- A4
- -
- Date:
- Reference:
- Sheet:
- of

### Library data of the parts
C64-C66 = MCD-00012: as C22 on sheet STM32 microcontroller Power; Internal_Part_Number: MCD-00012; Status: Released; Part_Type: Capacitor; Package: C0603; ComponentLink1Description: Datasheet; ComponentLink1URL: http://tunmcdsvn.tun.st.com/Component_Datasheet_Library/Trunk/Capacitors/Yageo_Multilayer_capacitor_X5R_series_100pF_to_100uF
C68 C69 C77 C81 C82 C86 C158 = MCD-00102: as C95 on sheet STM32 microcontroller Power; Internal_Part_Number: MCD-00102; Status: Released; Part_Type: Capacitor; Package: C0402; ComponentLink1Description: Datasheet; ComponentLink1URL: http://tunmcdsvn.tun.st.com/Component_Datasheet_Library/Trunk/Capacitors/Yageo_Multilayer_Capacitor_X7R_series_100pF_to_22uF
C74 C80 C84 C88 C91 C92 = MCD-00009: Capacitor, MLCC, 4.7uF, 16V, X5R, 10%, 0603, T=0.8mm; Manufacturer_Part_Number: CC0603KRX5R7BB475; Manufacturer: YAGEO; Provided_By: SUBCO; Internal_Part_Number: MCD-00009; Status: Released; Part_Type: Capacitor; Package: C0603; ComponentLink1Description: Datasheet; ComponentLink1URL: http://tunmcdsvn.tun.st.com/Component_Datasheet_Library/Trunk/Capacitors/Yageo_Multilayer_capacitor_X5R_series_100pF_to_100uF
C78 C79 C83 C89 C90 = MCD-00010: as C21 on sheet STM32 microcontroller Power; Internal_Part_Number: MCD-00010; Status: Released; Part_Type: Capacitor; Package: C0603; ComponentLink1Description: Datasheet; ComponentLink1URL: http://tunmcdsvn.tun.st.com/Component_Datasheet_Library/Trunk/Capacitors/Yageo_Multilayer_capacitor_X5R_series_100pF_to_100uF
CN10 = MCD-00018: Connector Jack socket Stereo 3.5mm, 3 pins, RA, SMT, Green (Line output); Manufacturer: QIAOD; Alternate_Manufacturer_Part_Number: PJ30280-3_GR; Provided_By: SUBCO; Internal_Part_Number: MCD-00018; Status: Released; Part_Type: Connector; Manufacturer_Part_Number: PJ3028B-3_GR; Alternate_Manufacturer: QIAOD; ComponentLink1Description: Datasheet; ComponentLink1URL: http://tunmcdsvn.tun.st.com/Component_Datasheet_Library/Trunk/Connectors/QIAOD_PJ-3028B-3-XX
CN11 = MCD-00682: Connector Jack socket Stereo 3.5mm, 3 pins, RA, SMT, Blue (Line input); Manufacturer: QIAOD; Alternate_Manufacturer_Part_Number: PJ30280-3_BE; Provided_By: SUBCO; Internal_Part_Number: MCD-00682; Status: Footprint available; Part_Type: Connector; Manufacturer_Part_Number: PJ3028B-3_BE; Alternate_Manufacturer: QIAOD; ComponentLink1Description: Datasheet; ComponentLink1URL: http://tunmcdsvn.tun.st.com/Component_Datasheet_Library/Trunk/Connectors/QIAOD_PJ-3028B-3-XX
CN12 CN13 = MCD-00045: Header, 2x1, 2,54mm, VR, TH, Height 5.84mm/2.54mm; Part_Type: Connector; Manufacturer_Part_Number: TSW-102-07-x-S; Manufacturer: SAMTEC; Alternate_Manufacturer_Part_Number: 313102S111116; Alternate_Manufacturer: JIUBABA; Value: Shunt not fitted; Provided_By: SUBCO; Internal_Part_Number: MCD-00045; Status: Released; ComponentLink1Description: Datasheet; ComponentLink1URL: http://tunmcdsvn.tun.st.com/Component_Datasheet_Library/Trunk/Connectors/Samtec_TSW-HTSW-series
R84 R85 = MCD-00345: Resistor,20R,0603,1%,1/10W; Manufacturer_Part_Number: RC0603FR-0720RL; Manufacturer: YAGEO; Provided_By: SUBCO; Internal_Part_Number: MCD-00345; Status: Released; Part_Type: Resistor; Package: R0603; ComponentLink1Description: Datasheet; ComponentLink1URL: http://tunmcdsvn.tun.st.com/Component_Datasheet_Library/Trunk/Resistors/Yageo_Resistor_RC0603-series
R86 = MCD-00219: Resistor,4K7,0603,1%,1/10W; Manufacturer_Part_Number: RC0603FR-074K7L; Manufacturer: YAGEO; Provided_By: SUBCO; Internal_Part_Number: MCD-00219; Status: Released; Part_Type: Resistor; Package: R0603; ComponentLink1Description: Datasheet; ComponentLink1URL: http://tunmcdsvn.tun.st.com/Component_Datasheet_Library/Trunk/Resistors/Yageo_Resistor_RC0603-series
R90 R92 = MCD-00068: Resistor,1K5,0402,1%,1/16W; Manufacturer_Part_Number: RC0402FR-071K5L; Manufacturer: YAGEO; Provided_By: SUBCO; Internal_Part_Number: MCD-00068; Status: Released; Part_Type: Resistor; Package: R0402; ComponentLink1Description: Datasheet; ComponentLink1URL: http://tunmcdsvn.tun.st.com/Component_Datasheet_Library/Trunk/Resistors/Yageo_Resistor_RC0402-series
R94 R154 = MCD-00053: Resistor,10K,0402,1%,1/16W; Manufacturer_Part_Number: RC0402FR-0710KL; Manufacturer: YAGEO; Provided_By: SUBCO; Internal_Part_Number: MCD-00053; Status: Released; Part_Type: Resistor; Package: R0402; ComponentLink1Description: Datasheet; ComponentLink1URL: http://tunmcdsvn.tun.st.com/Component_Datasheet_Library/Trunk/Resistors/Yageo_Resistor_RC0402-series
  R94: Value: 10K
SB28 SB35-SB40 = MCD-00071: as SB1 on sheet STM32 microcontroller Power; Internal_Part_Number: MCD-00071; Status: Released; Package: SB0603; ComponentLink1Description: Datasheet; ComponentLink1URL: http://tunmcdsvn.tun.st.com/Component_Datasheet_Library/Trunk/Resistors/Yageo_Resistor_RC0603-series
U12 = MCD-00079: Multi-Channel Audio Hub CODEC for Smartphones; Part_Type: IC; Manufacturer: CIRRUS LOGIC; Provided_By: SUBCO; Internal_Part_Number: MCD-00079; Value: WM8994ECS/R; Status: Released; Manufacturer_Part_Number: WM8994ECS/R; ComponentLink1Description: Datasheet; ComponentLink1URL: http://tunmcdsvn.tun.st.com/Component_Datasheet_Library/Trunk/IC/Wolfson_AudioCodec_WM8994
U19 = MCD-00247: Quad Bidir ESD protection; Part_Type: Diode; Manufacturer: STMICROELECTRONICS; BMS_Part_Number: 9179038; Provided_By: SUBCO with ST control; Internal_Part_Number: MCD-00247; Value: ESDA6V1BC6; Status: Released; Manufacturer_Part_Number: ESDA6V1BC6; ComponentLink1Description: Datasheet; ComponentLink1URL: http://tunmcdsvn.tun.st.com/Component_Datasheet_Library/Trunk/Diodes/STM_ESD_ESDA6V1BC6
U33 = MCD-00081: MEMS audio sensor, omnidirectional digital microphone; Part_Type: IC; Manufacturer: STMICROELECTRONICS; BMS_Part_Number: 9188008; Provided_By: SUBCO with ST control; Internal_Part_Number: MCD-00081; Value: MP34DT01TR-M; Status: NRND (Not Recommended for New Design); Manufacturer_Part_Number: MP34DT01TR-M; ComponentLink1Description: Datasheet; ComponentLink1URL: http://tunmcdsvn.tun.st.com/Component_Datasheet_Library/Trunk/IC/STM_Digital-Microphone_MP34DT01TR_M